# EAGLE design DCC mDecoder (EAGLE 9.6.2)
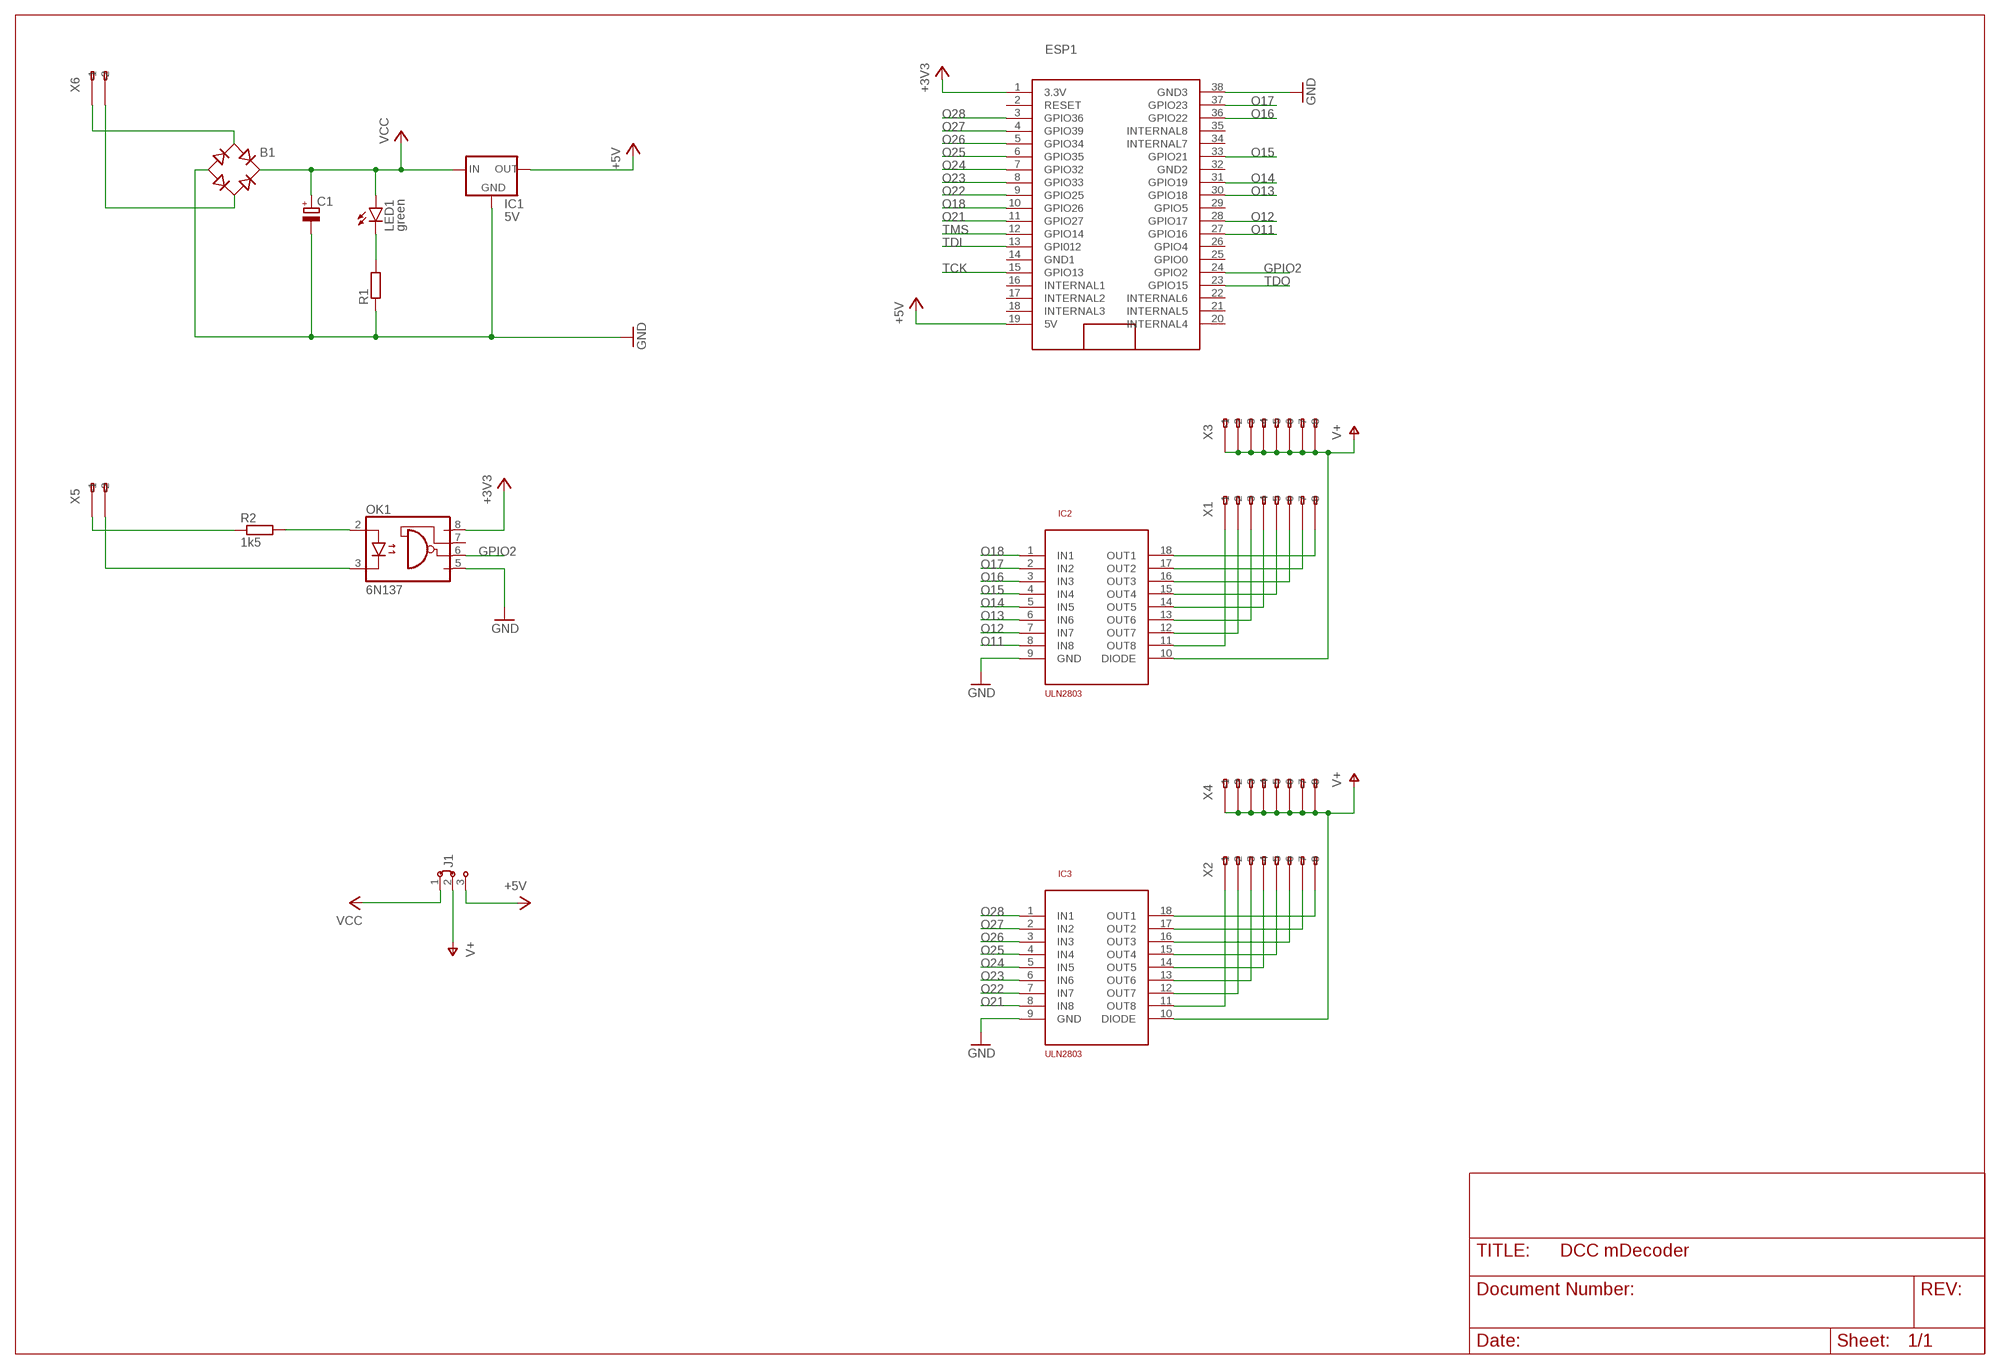
[diagram p0: schematic, sheet 1]

## Parts
B1  RB1A  [RB1A]
C1  CPOL-EUE5-8.5  [E5-8,5]
ESP1  ESP32-NODEMCU  [ESP32_NODEMCU]
IC1  5V  78XXS  [78XXS]
IC2  ULN2803  ULN2803DIL18  [DIL18]
IC3  ULN2803  ULN2803DIL18  [DIL18]
J1  J2X2MM  [04C]
LED1  green  TLLG4400  [LED3MM]
OK1  6N137  [DIL08]
R1  R-EU_0207/10  [0207/10]
R2  1k5  R-EU_0207/10  [0207/10]
X1  233-508  [233-508]
X2  233-508  [233-508]
X3  233-508  [233-508]
X4  233-508  [233-508]
X5  233-202  [233-202]
X6  233-202  [233-202]

## Nets
+3V3: ESP1.1(3.3V) OK1.8(VCC)
+5V: ESP1.19(5V) IC1.OUT J1.3
GND: B1.- C1.- ESP1.38(GND3) IC1.GND IC2.9(GND) IC3.9(GND) OK1.5(GND) R1.1
GPIO2: ESP1.24(GPIO2) OK1.6(VO)
N$1: IC2.11(OUT8) X1.A1(-1)
N$2: IC2.12(OUT7) X1.A2(-2)
N$3: LED1.K(C) R1.2
N$4: IC2.13(OUT6) X1.A3(-3)
N$5: B1.AC1 X6.A1(-1)
N$6: B1.AC2 X6.A2(-2)
N$7: IC2.14(OUT5) X1.A4(-4)
N$8: IC2.15(OUT4) X1.A5(-5)
N$9: R2.1 X5.A1(-1)
N$10: OK1.2(A) R2.2
N$11: OK1.3(C) X5.A2(-2)
N$12: IC2.16(OUT3) X1.A6(-6)
N$13: IC2.17(OUT2) X1.A7(-7)
N$14: IC2.18(OUT1) X1.A8(-8)
N$16: IC3.18(OUT1) X2.A8(-8)
N$17: IC3.17(OUT2) X2.A7(-7)
N$18: IC3.16(OUT3) X2.A6(-6)
N$19: IC3.15(OUT4) X2.A5(-5)
N$20: IC3.14(OUT5) X2.A4(-4)
N$21: IC3.13(OUT6) X2.A3(-3)
N$22: IC3.12(OUT7) X2.A2(-2)
N$23: IC3.11(OUT8) X2.A1(-1)
O11: ESP1.27(GPIO16) IC2.8(IN8)
O12: ESP1.28(GPIO17) IC2.7(IN7)
O13: ESP1.30(GPIO18) IC2.6(IN6)
O14: ESP1.31(GPIO19) IC2.5(IN5)
O15: ESP1.33(GPIO21) IC2.4(IN4)
O16: ESP1.36(GPIO22) IC2.3(IN3)
O17: ESP1.37(GPIO23) IC2.2(IN2)
O18: ESP1.10(GPIO26) IC2.1(IN1)
O21: ESP1.11(GPIO27) IC3.8(IN8)
O22: ESP1.9(GPIO25) IC3.7(IN7)
O23: ESP1.8(GPIO33) IC3.6(IN6)
O24: ESP1.7(GPIO32) IC3.5(IN5)
O25: ESP1.6(GPIO35) IC3.4(IN4)
O26: ESP1.5(GPIO34) IC3.3(IN3)
O27: ESP1.4(GPIO39) IC3.2(IN2)
O28: ESP1.3(GPIO36) IC3.1(IN1)
TCK: ESP1.15(GPIO13)
TDI: ESP1.13(GPI012)
TDO: ESP1.23(GPIO15)
TMS: ESP1.12(GPIO14)
V+: IC2.10(DIODE) IC3.10(DIODE) J1.2 X3.A1(-1) X3.A2(-2) X3.A3(-3) X3.A4(-4) X3.A5(-5) X3.A6(-6) X3.A7(-7) X3.A8(-8) X4.A1(-1) X4.A2(-2) X4.A3(-3) X4.A4(-4) X4.A5(-5) X4.A6(-6) X4.A7(-7) X4.A8(-8)
VCC: B1.+ C1.+ IC1.IN J1.1 LED1.A
Unconnected: ESP1.2(RESET) ESP1.16(INTERNAL1) ESP1.17(INTERNAL2) ESP1.18(INTERNAL3) ESP1.20(INTERNAL4) ESP1.21(INTERNAL5) ESP1.22(INTERNAL6) ESP1.25(GPIO0) ESP1.26(GPIO4) ESP1.29(GPIO5) ESP1.34(INTERNAL7) ESP1.35(INTERNAL8) OK1.7(VE) X1.B1(B-1) X1.B2(B-2) X1.B3(B-3) X1.B4(B-4) X1.B5(B-5) X1.B6(B-6) X1.B7(B-7) X1.B8(B-8) X2.B1(B-1) X2.B2(B-2) X2.B3(B-3) X2.B4(B-4) X2.B5(B-5) X2.B6(B-6) X2.B7(B-7) X2.B8(B-8) X3.B1(B-1) X3.B2(B-2) X3.B3(B-3) X3.B4(B-4) X3.B5(B-5) X3.B6(B-6) X3.B7(B-7) X3.B8(B-8) X4.B1(B-1) X4.B2(B-2) X4.B3(B-3) X4.B4(B-4) X4.B5(B-5) X4.B6(B-6) X4.B7(B-7) X4.B8(B-8) X5.B1(B-1) X5.B2(B-2) X6.B1(B-1) X6.B2(B-2)

## Power pins joined to a net without a drawn wire
GND1: ESP1.14(GND1)
GND2: ESP1.32(GND2)

## Library data of the parts
B1 = rectifier:RB1A: RECTIFIER 1 A
C1 = rcl:CPOL-EU: POLARIZED CAPACITOR, European symbol; SPICEPREFIX: C
ESP1 = _esp32:ESP32-NODEMCU
IC1 = v-reg:78XXS: VOLTAGE REGULATOR
IC2 IC3 = _eigene:ULN2803
J1 = jumper:J2: Jumper switch 2 x 2.5 mm
LED1 = led:TLLG4400: Low Current (2mA) LED 3 mm Tinted Diffused Package color GREEN Source: Data sheet <http://www.farnell.com/datasheets/391098.pdf>; MF: VISHAY SEMICONDUCTOR; OC_FARNELL: 1612435
OK1 = optocoupler:6N137: MOTOROLA OPTO COUPLER; MPN: 6N137; OC_FARNELL: 1328376; OC_NEWARK: 52M1895
R1 R2 = rcl:R-EU_: RESISTOR, European symbol; SPICEPREFIX: R
X1-X4 = con-wago255:233-508: WAGO; MF: Wago Corporation; MPN: 0233-0508; OC_FARNELL: 1777101; OC_NEWARK: 79K2053
X5 X6 = con-wago255:233-202: WAGO; MPN: 233-202; OC_FARNELL: 1283532; OC_NEWARK: 28K9059

## Board
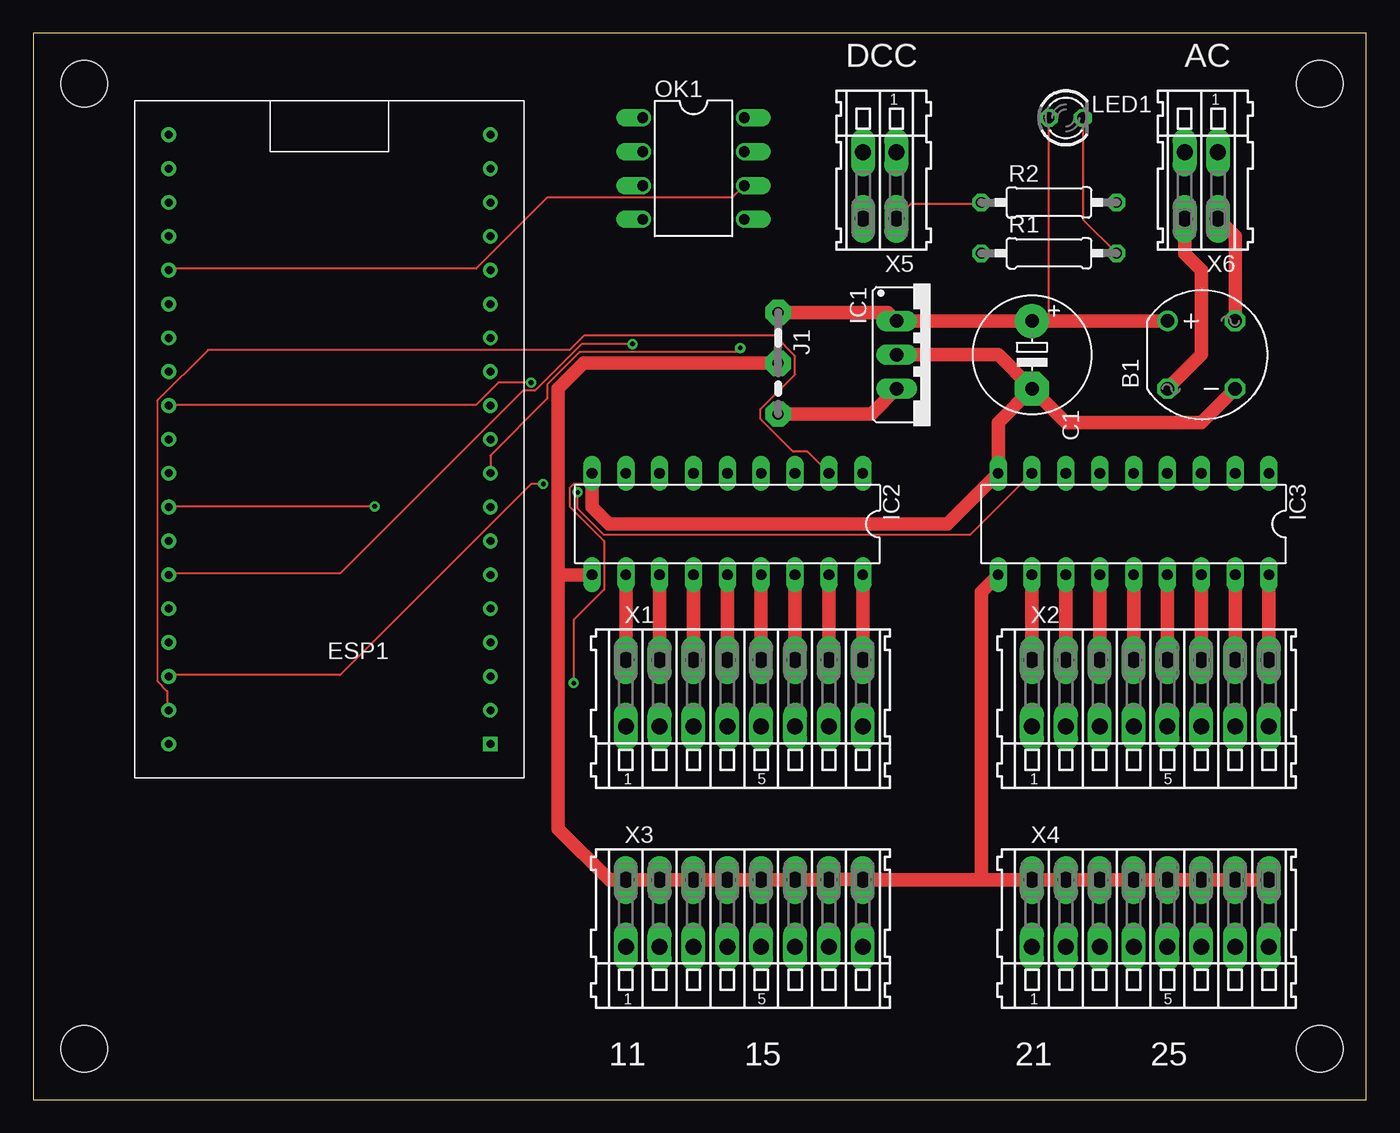
[diagram p1: board, top side]
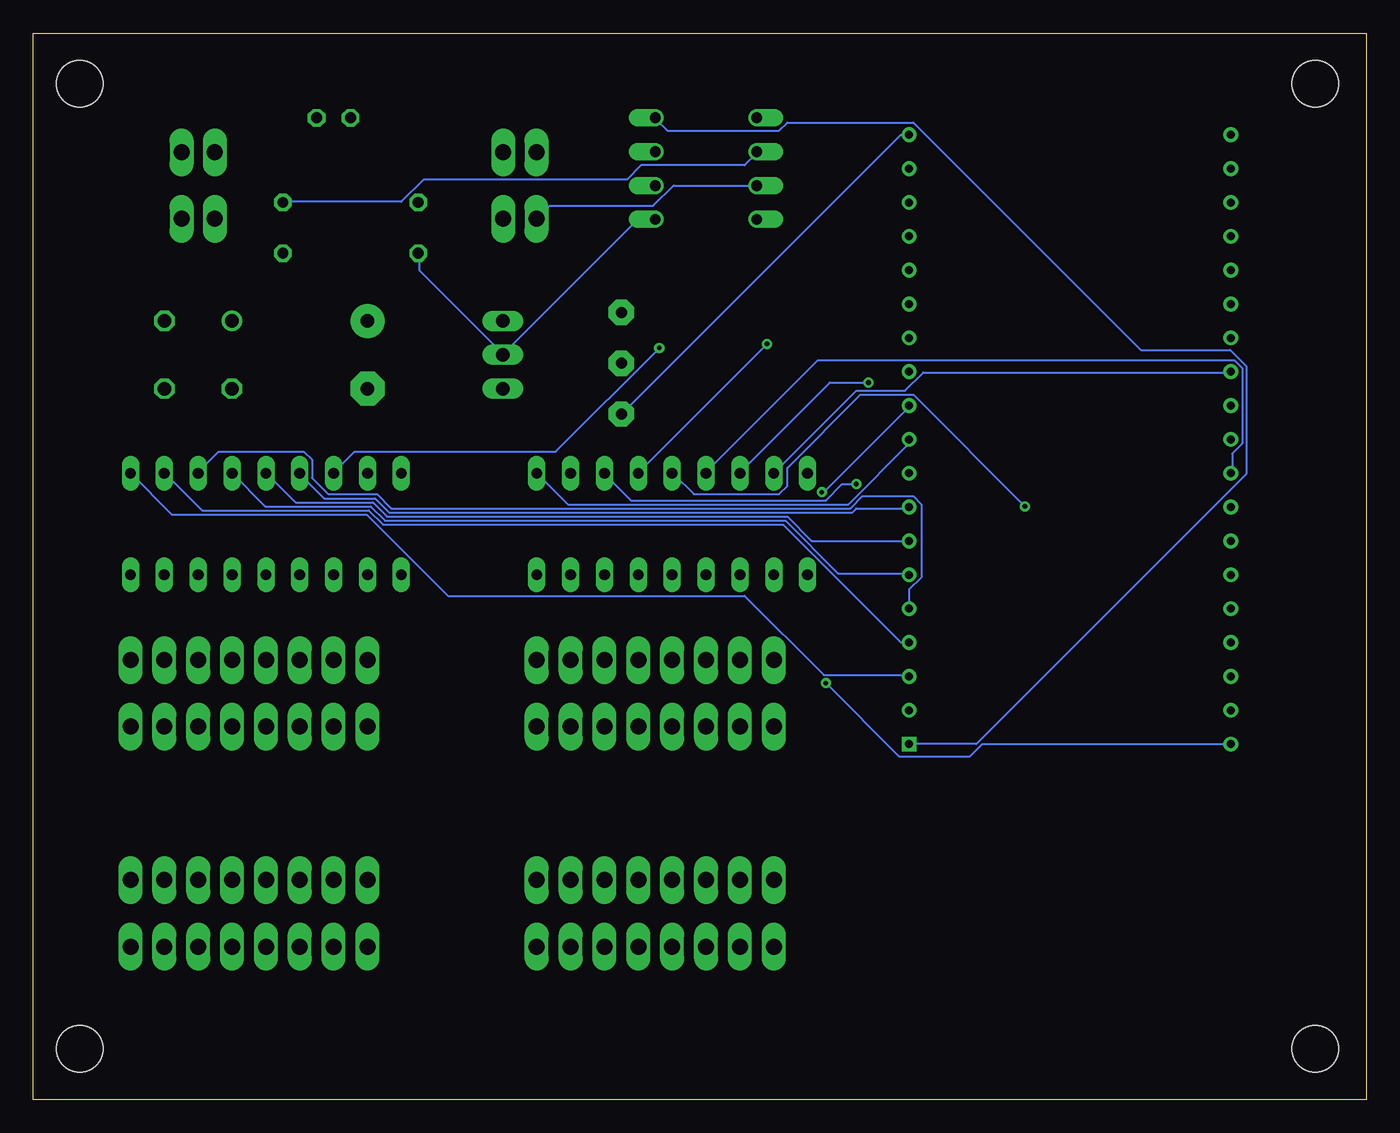
[diagram p2: board, bottom side, seen from below]

Size 100 x 80 mm. Coordinates in mm from the lower left corner, seen from the top.
Outline: 0,0 100,0 100,80 0,80 0,0
Copper layers (1*16): Top 0.035mm / dielectric 1.5mm / Bottom 0.035mm
Design rules "default": minimum track width 6mil, minimum drill 0.35mm, track to track 6mil, track to pad 6mil, pad to pad 6mil, via to via 6mil, smd to smd 6mil, copper to edge 40mil, drill to drill 6mil, minimum pad ring 10mil, minimum via ring 8mil, stop-mask expansion 4mil, vias tented up to drill 0mil, thermal gap 10mil
Holes 3.5 mm at 3.81,76.2 3.81,3.81 96.52,3.81 96.52,76.2

### Footprints (pad centres in the part's own frame; a part is rotated, then mirrored left to right if it is on the bottom)
RB1A = drill 1.016: + -2.54,2.54 | drill 1.016 octagon: - 2.54,-2.54; AC1 2.54,2.54; AC2 -2.54,-2.54
E5-8,5 = drill 1.016 pad 2.54: + -2.54,0 | drill 1.016 pad 2.54 octagon: - 2.54,0
ESP32_NODEMCU = drill 0.6 square: 1 0,33.02 | drill 0.6: 2 0,30.48; 3 0,27.94; 4 0,25.4; 5 0,22.86; 6 0,20.32; 7 0,17.78; 8 0,15.24; 9 0,12.7; 10 0,10.16; 11 0,7.62; 12 0,5.08; 13 0,2.54; 14 0,0; 15 0,-2.54; 16 0,-5.08; 17 0,-7.62; 18 0,-10.16; 19 0,-12.7; 20 24.13,-12.7; 21 24.13,-10.16; 22 24.13,-7.62; 23 24.13,-5.08; 24 24.13,-2.54; 25 24.13,0; 26 24.13,2.54; 27 24.13,5.08; 28 24.13,7.62; 29 24.13,10.16; 30 24.13,12.7; 31 24.13,15.24; 32 24.13,17.78; 33 24.13,20.32; 34 24.13,22.86; 35 24.13,25.4; 36 24.13,27.94; 37 24.13,30.48; 38 24.13,33.02
78XXS = drill 1.016 long: GND 0,-2.54; IN -2.54,-2.54; OUT 2.54,-2.54
DIL18 = drill 0.813 long: 1 -10.16,-3.81; 2 -7.62,-3.81; 3 -5.08,-3.81; 4 -2.54,-3.81; 5 0,-3.81; 6 2.54,-3.81; 7 5.08,-3.81; 8 7.62,-3.81; 9 10.16,-3.81; 10 10.16,3.81; 11 7.62,3.81; 12 5.08,3.81; 13 2.54,3.81; 14 0,3.81; 15 -2.54,3.81; 16 -5.08,3.81; 17 -7.62,3.81; 18 -10.16,3.81
04C = drill 0.813 pad 1.905 octagon: 1 -1.905,0; 2 1.905,0; 3 5.715,0
LED3MM = drill 0.813 octagon: A -1.27,0; K 1.27,0
DIL08 = drill 0.813 offset: 1 -3.81,-3.81; 2 -1.27,-3.81; 3 1.27,-3.81; 4 3.81,-3.81; 5 3.81,3.81; 6 1.27,3.81; 7 -1.27,3.81; 8 -3.81,3.81
0207/10 = drill 0.813 octagon: 1 -5.08,0; 2 5.08,0
233-508 = drill 1.2 long: A1 -8.89,2.5; A2 -6.35,2.5; A3 -3.81,2.5; A4 -1.27,2.5; A5 1.27,2.5; A6 3.81,2.5; A7 6.35,2.5; A8 8.89,2.5; B1 -8.89,-2.5; B2 -6.35,-2.5; B3 -3.81,-2.5; B4 -1.27,-2.5; B5 1.27,-2.5; B6 3.81,-2.5; B7 6.35,-2.5; B8 8.89,-2.5
233-202 = drill 1.2 long: A1 -1.25,2.5; A2 1.25,2.5; B1 -1.25,-2.5; B2 1.25,-2.5

### Placement (x,y rotation side)
B1  87.63,55.88 0 top
C1  74.93,55.88 270 top
ESP1  34.29,59.69 180 top
IC1  67.31,55.88 270 top
IC2  52.07,43.18 180 top
IC3  82.55,43.18 180 top
J1  55.88,57.15 270 top
LED1  77.47,73.66 0 top
OK1  49.53,69.85 270 top
R1  76.2,63.5 0 top
R2  76.2,67.31 0 top
X1  53.34,30.48 0 top
X2  83.82,30.48 0 top
X3  53.34,13.97 0 top
X4  83.82,13.97 0 top
X5  63.5,68.58 180 top
X6  87.63,68.58 180 top

### Tracks (layer width: path | path; a pad name or v marks a point on that pad's centre or on a via)
+3V3
  Bottom 0.152: ESP1.1 29.26,26.67 8.99,46.94 8.99,55.02 10.21,56.24 16.92,56.24 33.98,73.3 43.43,73.3 44.04,72.69 52.43,72.69 53.34,73.61 OK1.8
+5V
  Top 1.016: J1.3 62.87,51.44 IC1.OUT
  Bottom 0.152: ESP1.19 34.9,72.39 55.78,51.51 J1.3
GND  (via drill 0.35)
  Top 0.152: v40.54,31.24 40.54,35.97 42.82,38.25 42.82,41.91 40.23,44.5 40.23,45.87 40.54,46.18 41.45,46.18 IC2.9
  Top 1.016: B1.- 87.63,50.8 77.47,50.8 C1.- | C1.- 72.39,50.8 IC3.9 68.58,43.18 43.18,43.18 41.91,44.45 IC2.9 | IC1.GND 72.39,55.88 C1.-
  Bottom 0.152: ESP1.38 28.8,26.67 29.72,25.76 35.05,25.76 v40.54,31.24 | 64.77,55.93 71.02,62.18 71.02,63.4 R1.1 | 64.77,55.93 54.71,65.99 53.34,65.99 OK1.5 | 64.77,55.93 IC1.GND
GPIO2
  Top 0.152: OK1.6 52.43,67.67 38.56,67.67 33.22,62.33 10.21,62.33 ESP1.24
N$1
  Top 1.016: IC2.11 X1.A1
N$2
  Top 1.016: IC2.12 X1.A2
N$3
  Top 0.152: R1.2 78.79,65.99 78.79,73.61 LED1.K
N$4
  Top 1.016: IC2.13 X1.A3 49.53,31.75
N$5
  Top 1.016: X6.A1 90.17,64.79 B1.AC1
N$6
  Top 1.016: X6.A2 86.38,63.48 87.63,62.23 87.63,55.88 B1.AC2
N$7
  Top 1.016: IC2.14 X1.A4
N$8
  Top 1.016: IC2.15 X1.A5
N$9
  Top 0.152: R2.1 71.02,67.21 65.84,67.21 64.77,66.14 X5.A1
N$10
  Bottom 0.152: R2.2 81.23,67.36 72.39,67.36 70.71,69.04 55.47,69.04 54.41,70.1 46.63,70.1 45.72,71.02 OK1.2
N$11
  Bottom 0.152: OK1.3 51.97,68.58 53.49,67.06 61.27,67.06 62.18,66.14 X5.A2
N$12
  Top 1.016: IC2.16 X1.A6
N$13
  Top 1.016: IC2.17 X1.A7
N$14
  Top 1.016: IC2.18 X1.A8
N$16
  Top 1.016: IC3.18 X2.A8
N$17
  Top 1.016: IC3.17 X2.A7
N$18
  Top 1.016: IC3.16 X2.A6
N$19
  Top 1.016: IC3.15 X2.A5
N$20
  Top 1.016: IC3.14 X2.A4
N$21
  Top 1.016: IC3.13 X2.A3
N$22
  Top 1.016: IC3.12 X2.A2
N$23
  Top 1.016: IC3.11 X2.A1
O11
  Bottom 0.152: IC2.8 38.25,53.19 34.59,53.19 33.22,54.56 10.21,54.56 ESP1.27
O12  (via drill 0.35)
  Top 0.152: v37.34,53.8 34.9,53.8 33.22,52.12 10.21,52.12 ESP1.28
  Bottom 0.152: v37.34,53.8 40.23,53.8 46.94,47.09 IC2.7
O13
  Bottom 0.152: ESP1.30 10.06,47.09 10.06,48.46 9.3,49.23 9.3,54.86 9.91,55.47 41.15,55.47 49.53,47.09 IC2.6
O14  (via drill 0.35)
  Top 0.152: v25.6,44.5 10.21,44.5 ESP1.31
  Bottom 0.152: v25.6,44.5 33.98,52.88 37.95,52.88 43.43,47.4 43.43,46.02 44.04,45.41 50.44,45.41 51.97,46.94 IC2.5
O15  (via drill 0.35)
  Top 0.152: v44.96,56.69 41.15,56.69 37.64,53.19 36.73,53.19 23.01,39.47 10.21,39.47 ESP1.33
  Bottom 0.152: v44.96,56.69 54.56,47.09 IC2.4
O16  (via drill 0.35)
  Top 0.152: v38.25,46.18 37.34,46.18 23.01,31.85 10.21,31.85 ESP1.36
  Bottom 0.152: v38.25,46.18 39.32,46.18 40.54,44.96 55.17,44.96 57.15,46.94 IC2.3
O17
  Top 0.152: IC2.2 58.06,48.62 57,48.62 54.56,51.05 54.56,51.82 57.15,54.41 57.15,55.78 55.63,57.3 41.3,57.3 40.23,56.24 13.11,56.24 9.3,52.43 9.3,31.39 10.06,30.63 10.06,29.26 ESP1.37
O18
  Bottom 0.152: ESP1.10 34.29,49.23 38.86,44.65 59.89,44.65 IC2.1
O21  (via drill 0.35)
  Top 0.152: v40.84,45.57 40.84,44.35 42.82,42.37 70.26,42.37 74.83,46.94 IC3.8
  Bottom 0.152: v40.84,45.57 40.69,45.57 34.29,51.97 ESP1.11
O22  (via drill 0.35)
  Top 0.152: ESP1.9 34.29,48.31 38.56,52.58 38.56,53.65 41,56.08 52.73,56.08 v53.03,56.39
  Bottom 0.152: v53.03,56.39 60.81,48.62 75.89,48.62 77.42,47.09 IC3.7
O23
  Bottom 0.152: ESP1.8 34.29,44.35 38.25,44.35 38.56,44.04 73.3,44.04 74.37,45.11 78.18,45.11 80.01,46.94 IC3.6
O24
  Bottom 0.152: ESP1.7 41.6,41.91 43.43,43.74 73.46,43.74 74.52,44.81 80.31,44.81 82.45,46.94 IC3.5
O25
  Bottom 0.152: IC3.4 82.6,44.5 74.68,44.5 73.61,43.43 43.59,43.43 39.62,39.47 34.29,39.47 ESP1.6
O26
  Bottom 0.152: ESP1.5 34.29,38.25 33.38,39.17 33.38,44.65 33.98,45.26 37.8,45.26 38.71,44.35 73.15,44.35 74.22,45.41 77.88,45.41 79.1,46.63 79.1,48.01 79.7,48.62 86.11,48.62 87.63,47.09 IC3.3
O27
  Bottom 0.152: ESP1.4 34.9,34.29 43.74,43.13 73.76,43.13 74.83,44.2 87.33,44.2 90.07,46.94 IC3.2
O28
  Bottom 0.152: IC3.1 89.61,43.89 74.98,43.89 68.89,37.8 46.63,37.8 40.69,31.85 34.29,31.85 ESP1.3
V+
  Top 1.016: 71.12,16.47 X3.A8 63.46,16.47 63.5,16.51 59.73,16.51 X3.A7 X3.A6 X3.A5 X3.A4 X3.A3 X3.A2 X3.A1 43.22,16.47 39.37,20.32 39.37,39.37 | 71.12,16.47 X4.A1 X4.A2 X4.A3 X4.A4 X4.A5 X4.A6 X4.A7 X4.A8 | IC3.10 71.12,38.1 71.12,16.47 | J1.2 41.27,55.24 39.37,53.34 39.37,39.37 | IC2.10 39.37,39.37
VCC
  Top 0.152: 76.2,58.42 LED1.A
  Top 1.016: J1.1 64.14,59.05 IC1.IN C1.+ 76.2,58.42 B1.+

### Text on the board
tNames: DCC | AC | 11 | 15 | 21 | 25